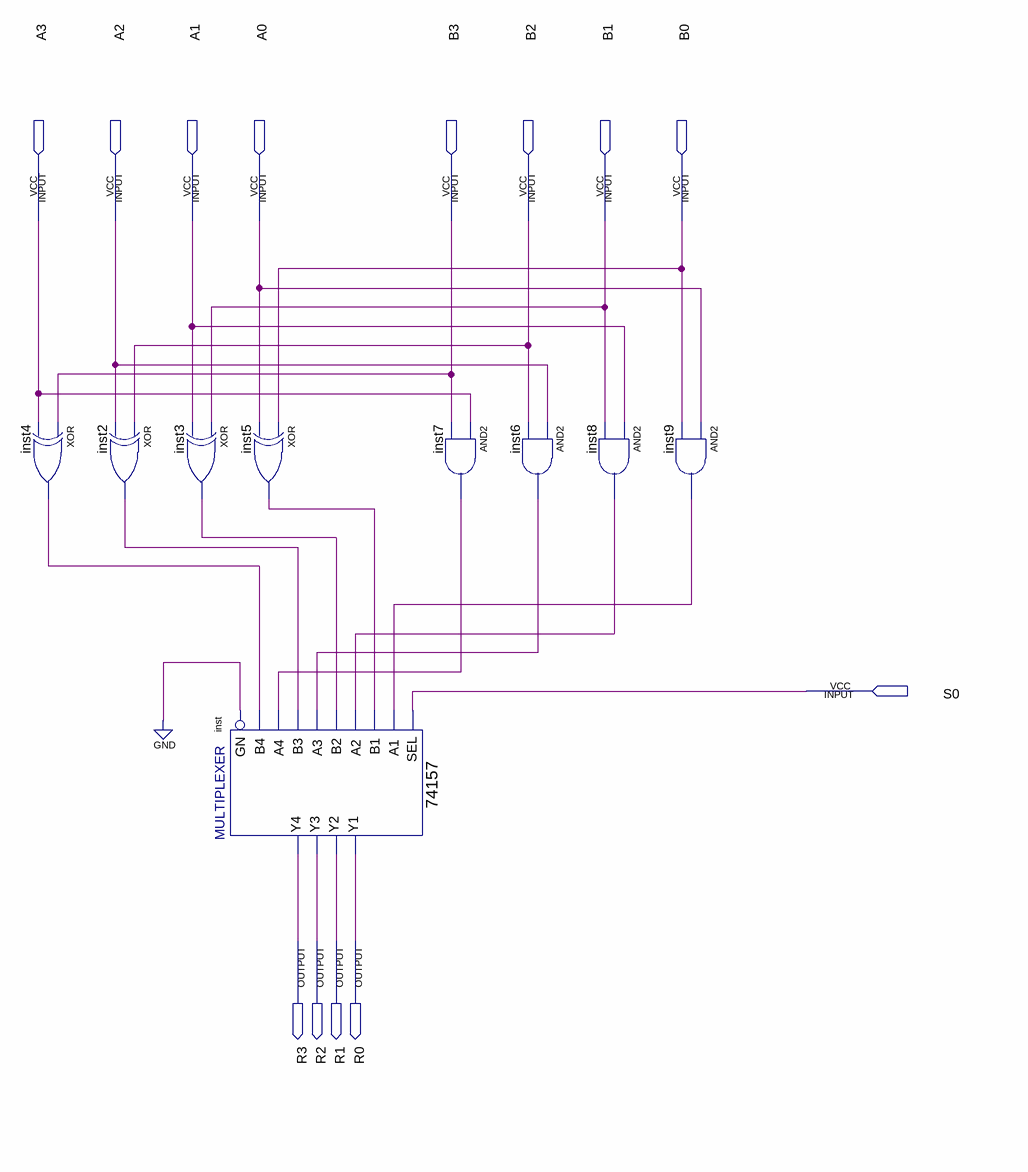
[diagram p0: schematic sheet]
// Quartus schematic AND_XOR.bdf as structural Verilog: 9 symbols, 13 pins
module AND_XOR (
  input  A3,
  input  A2,
  input  A1,
  input  A0,
  input  B3,
  input  B2,
  input  B1,
  input  B0,
  input  S0,
  output R3,
  output R2,
  output R1,
  output R0
);

  wire inst2_out, inst3_out, inst4_out, inst5_out, inst6_out, inst7_out, inst8_out, inst9_out;

  xor inst4 (inst4_out, B3, A3);
  xor inst2 (inst2_out, B2, A2);
  xor inst3 (inst3_out, B1, A1);
  xor inst5 (inst5_out, B0, A0);
  \74157  inst (
    .A1(inst9_out), .B1(inst5_out), .SEL(S0), .B2(inst3_out), .A3(inst6_out), .B3(inst2_out), .A2(inst8_out),
    .B4(inst4_out), .GN(1'b0), .A4(inst7_out), .Y2(R1), .Y1(R0), .Y4(R3), .Y3(R2));
  and inst7 (inst7_out, A3, B3);
  and inst6 (inst6_out, A2, B2);
  and inst8 (inst8_out, A1, B1);
  and inst9 (inst9_out, A0, B0);
endmodule
